# EAGLE schematic buffered-mult (EAGLE 7.2.0)
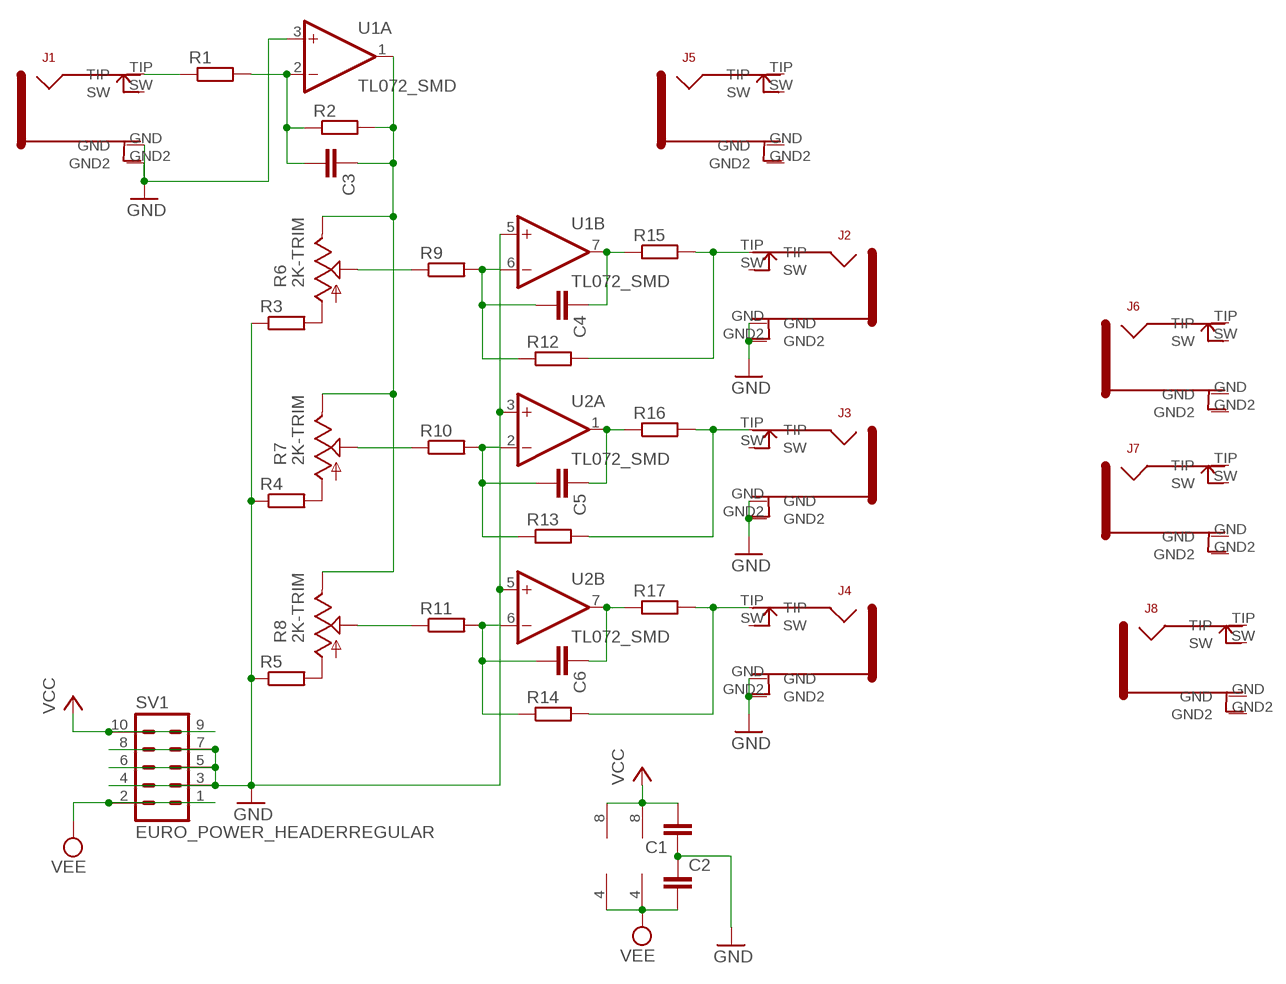
[diagram p0: schematic, sheet 1]

## Parts
C1  C-EUC0603  [C0603]
C2  C-EUC0603  [C0603]
C3  C-EUC0603  [C0603]
C4  C-EUC0603  [C0603]
C5  C-EUC0603  [C0603]
C6  C-EUC0603  [C0603]
J1  WQP_PJ_301BM  [WQP_PJ_301BM]
J2  WQP_PJ_301BM  [WQP_PJ_301BM]
J3  WQP_PJ_301BM  [WQP_PJ_301BM]
J4  WQP_PJ_301BM  [WQP_PJ_301BM]
J5  WQP_PJ_301BM  [WQP_PJ_301BM]
J6  WQP_PJ_301BM  [WQP_PJ_301BM]
J7  WQP_PJ_301BM  [WQP_PJ_301BM]
J8  WQP_PJ_301BM  [WQP_PJ_301BM]
R1  R-EU_R0603  [R0603]
R2  R-EU_R0603  [R0603]
R3  R-EU_R0603  [R0603]
R4  R-EU_R0603  [R0603]
R5  R-EU_R0603  [R0603]
R6  2K-TRIM  BOURNS_TRIM_3303X3_SMD  [BOURNS_TRIM_3303X3_SMD]
R7  2K-TRIM  BOURNS_TRIM_3303X3_SMD  [BOURNS_TRIM_3303X3_SMD]
R8  2K-TRIM  BOURNS_TRIM_3303X3_SMD  [BOURNS_TRIM_3303X3_SMD]
R9  R-EU_R0603  [R0603]
R10  R-EU_R0603  [R0603]
R11  R-EU_R0603  [R0603]
R12  R-EU_R0603  [R0603]
R13  R-EU_R0603  [R0603]
R14  R-EU_R0603  [R0603]
R15  R-EU_R0603  [R0603]
R16  R-EU_R0603  [R0603]
R17  R-EU_R0603  [R0603]
SV1  EURO_POWER_HEADERREGULAR  [EURO_POWER_HEADER]
U1  TL072_SMD  [SO08]
U2  TL072_SMD  [SO08]

## Nets
GND: C1.1 C2.1 J1.GND J1.GND2 J2.GND J2.GND2 J3.GND J3.GND2 J4.GND J4.GND2 R3.1 R4.1 R5.1 SV1.3 SV1.4 SV1.5 SV1.6 SV1.7 SV1.8 U1.3(A:+IN) U1.5(B:+IN) U2.3(A:+IN) U2.5(B:+IN)
N$1: J1.TIP R1.1
N$2: C3.2 R1.2 R2.1 U1.2(A:-IN)
N$3: C4.1 R15.1 U1.7(B:OUT)
N$4: R3.2 R6.3(A)
N$5: R4.2 R7.3(A)
N$6: R5.2 R8.3(A)
N$7: C4.2 R9.2 R12.1 U1.6(B:-IN)
N$8: R6.2(S) R9.1
N$9: C5.2 R10.2 R13.1 U2.2(A:-IN)
N$13: C6.2 R11.2 R14.1 U2.6(B:-IN)
N$14: R7.2(S) R10.1
N$15: R8.2(S) R11.1
N$16: C3.1 R2.2 R6.1(E) R7.1(E) R8.1(E) U1.1(A:OUT)
N$18: J2.TIP R12.2 R15.2
N$19: C5.1 R16.1 U2.1(A:OUT)
N$20: J3.TIP R13.2 R16.2
N$22: C6.1 R17.1 U2.7(B:OUT)
N$23: J4.TIP R14.2 R17.2
VCC: C1.2 SV1.9 SV1.10 U1.8(P:V+) U2.8(P:V+)
VEE: C2.2 SV1.1 SV1.2 U1.4(P:V-) U2.4(P:V-)
Unconnected: J1.SW J2.SW J3.SW J4.SW J5.GND J5.GND2 J5.SW J5.TIP J6.GND J6.GND2 J6.SW J6.TIP J7.GND J7.GND2 J7.SW J7.TIP J8.GND J8.GND2 J8.SW J8.TIP

## Library data of the parts
C1-C6 = rcl:C-EU: CAPACITOR, European symbol
J1-J8 = mjb-pots:WQP_PJ_301BM
R1-R5 R9-R17 = resistor:R-EU_: RESISTOR, European symbol
R6-R8 = mjb-parts:BOURNS_TRIM_3303X3_SMD
SV1 = MusicThingModular:EURO_POWER_HEADER: Power Header 10 pin power header for Eurorack Power Supplies Variants with fatter pads for easier soldering, and the LOCK variant which has 5mil offset pins to hold the component in place before soldering
U1 U2 = MusicThingModular:TL072: Generic Dual Op Amp